# EAGLE design ble113_breakout_board_v11 (EAGLE 7.7.0)
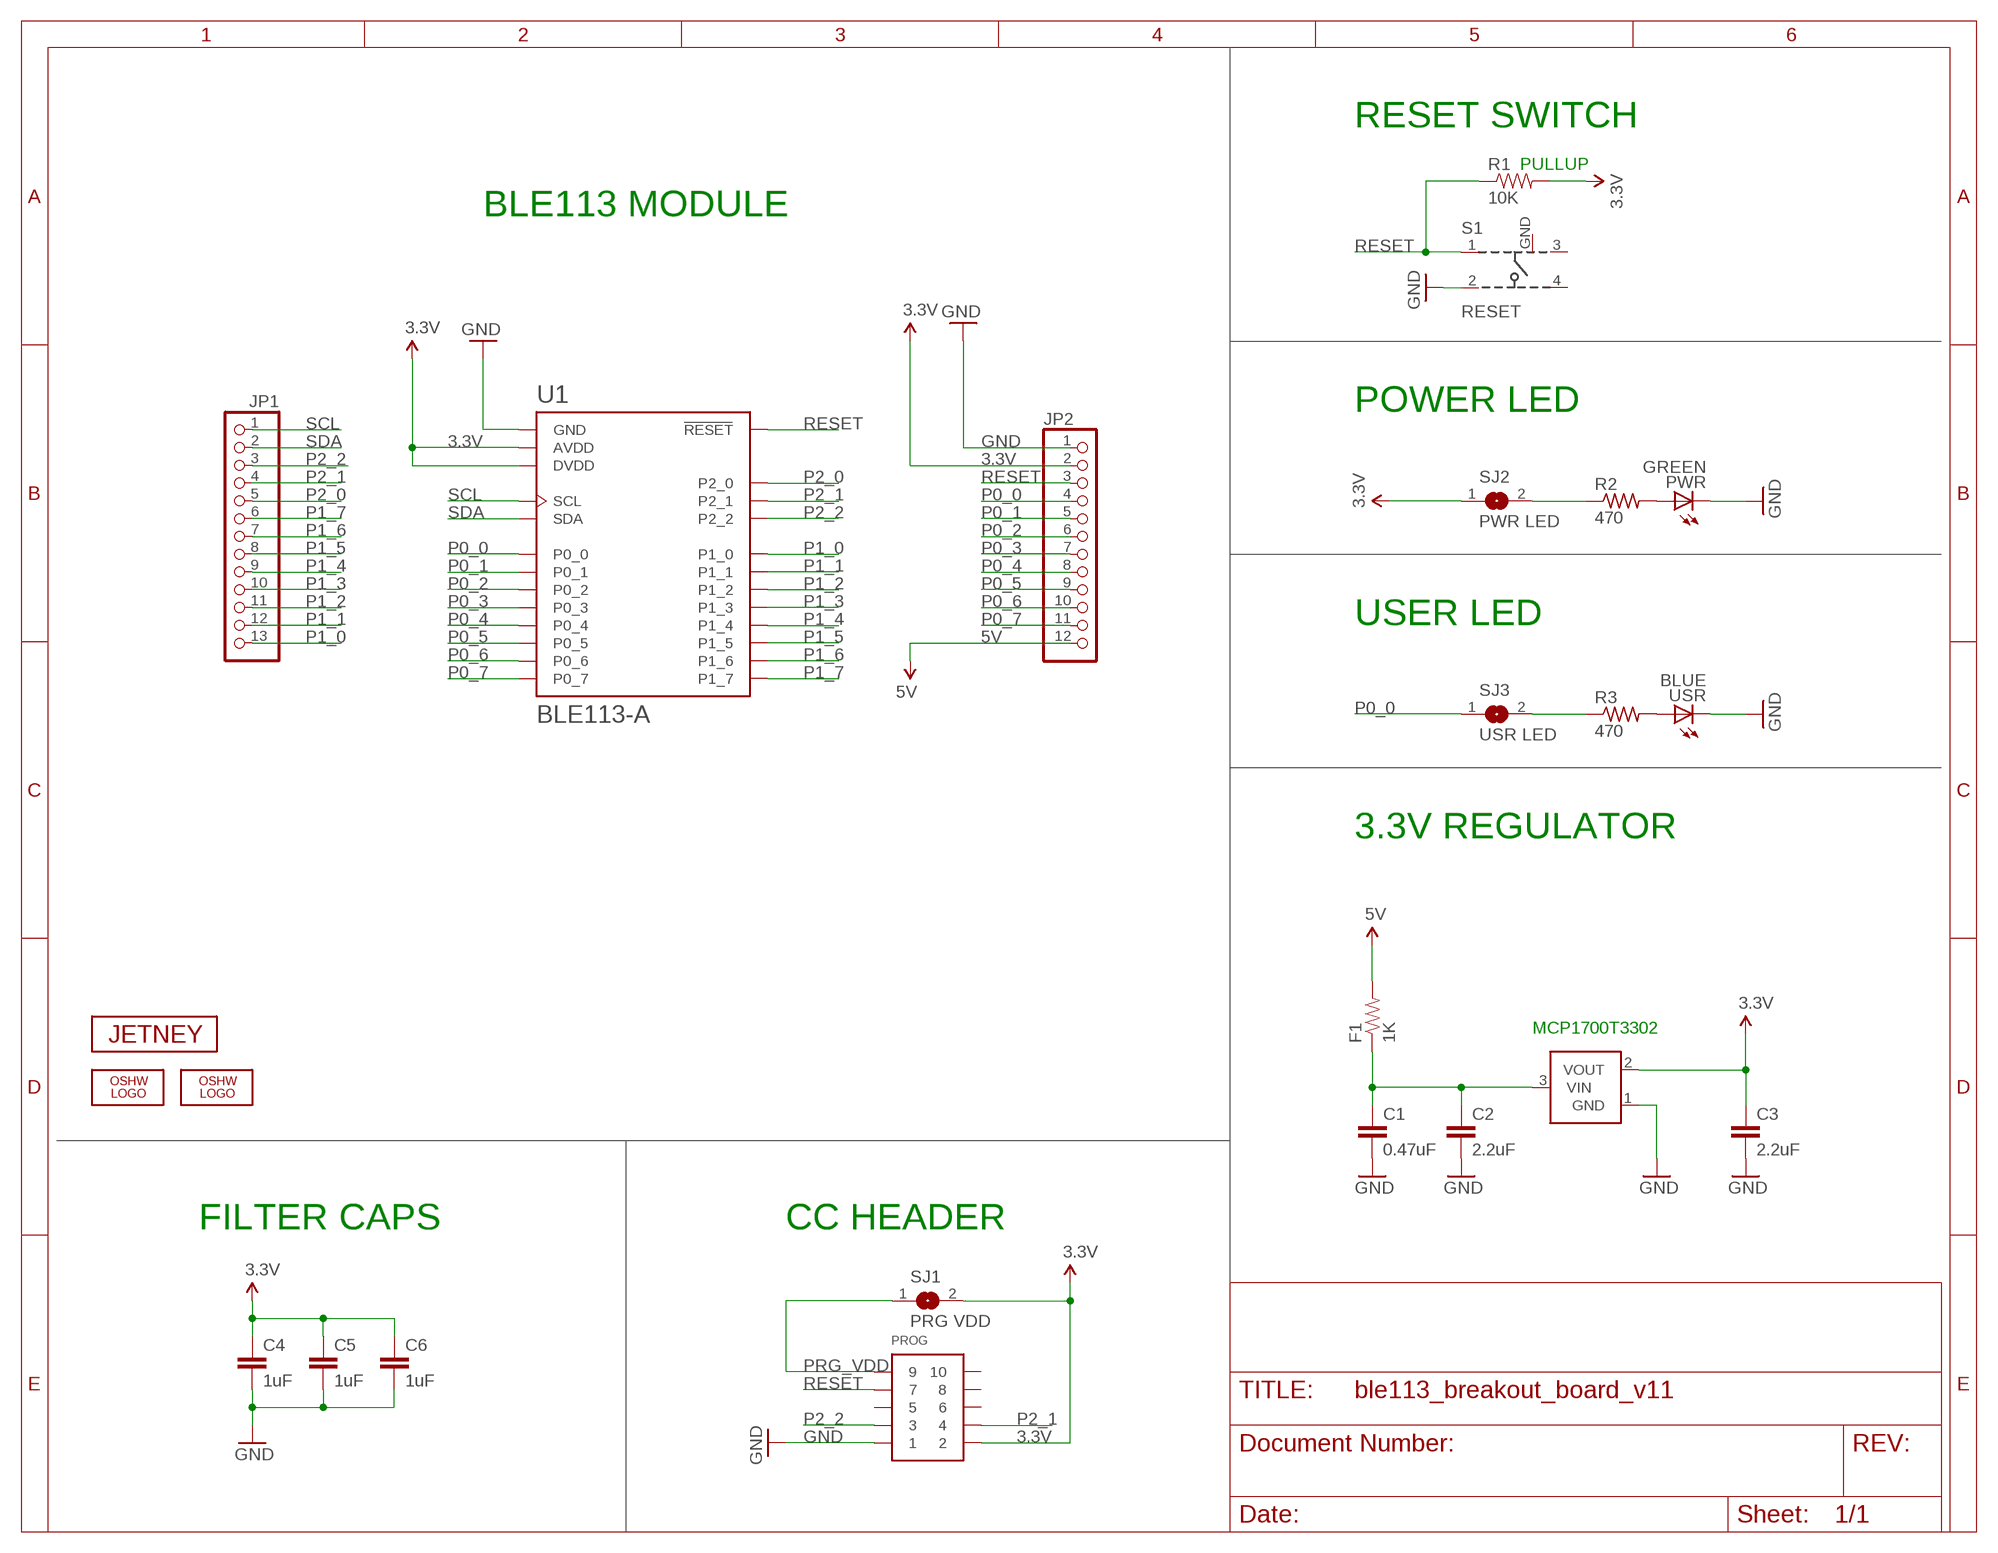
[diagram p0: schematic, sheet 1]

## Parts
C1  0.47uF  CAP0603-CAP  [0603-CAP]
C2  2.2uF  CAP0603-CAP  [0603-CAP]
C3  2.2uF  CAP0603-CAP  [0603-CAP]
C4  1uF  CAP0603-CAP  [0603-CAP]
C5  1uF  CAP0603-CAP  [0603-CAP]
C6  1uF  CAP0603-CAP  [0603-CAP]
F1  1K  RESISTOR0805-RES  [0805]
JP1  PINHD-1X13  [1X13]
JP2  PINHD-1X12  [1X12]
LOGO1  OSHW_LOGO_FILLX0100-NT  [OSHW_FILLX100_NOTEXT]
LOGO2  OSHW_LOGO_FILLX0070-NT  [OSHW_FILLX70_NOTEXT]
PROG  CONN_5-2-FTSH-V  [FTSH-105-DV]
PWR  GREEN  LEDCHIPLED_0805  [CHIPLED_0805]
R1  10K  RESISTOR0603-RES  [0603-RES]
R2  470  R-US_R0603  [R0603]
R3  470  R-US_R0603  [R0603]
S1  RESET  101-IG  [101-IG]
SJ1  PRG VDD  SJ  [SJ]
SJ2  PWR LED  SJ  [SJ]
SJ3  USR LED  SJ  [SJ]
U1  BLE113-A  [BLE113-A]
U2  MCP1700  [SOT23-3]
U$2  JETNEY-LOGO-12  [JETNEY-LOGO-12]
USR  BLUE  LEDCHIPLED_0805  [CHIPLED_0805]

## Nets
3.3V [power]: C3.1 C4.1 C5.1 C6.1 JP2.2 PROG.2 R1.2 SJ1.2 SJ2.1 U1.AVDD U1.DVDD U2.2(VOUT)
5V [power]: F1.2 JP2.12
5VF [power]: C1.1 C2.1 F1.1 U2.3(VIN)
GND [power]: C1.2 C2.2 C3.2 C4.2 C5.2 C6.2 JP2.1 PROG.1 PWR.C S1.2 U1.GND U1.GND@2(GND) U1.GND@3(GND) U1.GND@4(GND) U1.GND@5(GND) U1.GND@6(GND) U1.GND@7(GND) U1.GND@8(GND) U1.GND@9(GND) U1.GND@10(GND) U2.1(GND) USR.C
N$1: PWR.A R2.2
N$3 [power]: R2.1 SJ2.2
N$4: R3.2 USR.A
N$5: R3.1 SJ3.2
P0_0: JP2.4 SJ3.1 U1.P0_0
P0_1: JP2.5 U1.P0_1
P0_2: JP2.6 U1.P0_2
P0_3: JP2.7 U1.P0_3
P0_4: JP2.8 U1.P0_4
P0_5: JP2.9 U1.P0_5
P0_6: JP2.10 U1.P0_6
P0_7: JP2.11 U1.P0_7
P1_0: JP1.13 U1.P1_0
P1_1: JP1.12 U1.P1_1
P1_2: JP1.11 U1.P1_2
P1_3: JP1.10 U1.P1_3
P1_4: JP1.9 U1.P1_4
P1_5: JP1.8 U1.P1_5
P1_6: JP1.7 U1.P1_6
P1_7: JP1.6 U1.P1_7
P2_0: JP1.5 U1.P2_0
P2_1: JP1.4 PROG.4 U1.P2_1
P2_2: JP1.3 PROG.3 U1.P2_2
PRG_VDD [power]: PROG.9 SJ1.1
RESET: JP2.3 PROG.7 R1.1 S1.1 U1.RESET
SCL: JP1.1 U1.SCL
SDA: JP1.2 U1.SDA
Unconnected: PROG.5 PROG.6 PROG.8 PROG.10 S1.3 S1.4

## Notes on the sheet
- RESET SWITCH
- PULLUP
- BLE113 MODULE
- POWER LED
- USER LED
- 3.3V REGULATOR
- MCP1700T3302
- FILTER CAPS | CC HEADER

## Power pins joined to a net without a drawn wire
GND: S1.GND

## Library data of the parts
C1-C6 = SparkFun:CAP: Capacitor Standard 0603 ceramic capacitor, and 0.1" leaded capacitor.
F1 R1 = SparkFun:RESISTOR: Resistor Basic schematic elements and footprints for 0603, 1206, and PTH resistors.
JP1 = sf-pinhead:PINHD-1X13: PIN HEADER
JP2 = sf-pinhead:PINHD-1X12: PIN HEADER
LOGO1 LOGO2 = oshw-logo:OSHW_LOGO_FILL
PROG = pel_misc:CONN_5-2
PWR USR = led:LED: LED OSRAM: - CHIPLED LG R971, LG N971, LY N971, LG Q971, LY Q971, LO R971, LY R971 LH N974, LH R974 LS Q976, LO Q976, LY Q976 LO Q996 - Hyper CHIPLED LW Q18S LB Q993, LB Q99A, LB R99A - SideLED LS A670, LO A670, LY A670, LG A670, LP A670 LB A673, LV A673, LT A673, LW A673 LH A674 LY A675 LS A676, LA A676, LO A676, LY A676, LW A676 LS A679, LY A679, LG A679 - Hyper Micro SIDELED® LS Y876, LA Y876, LO Y876, LY Y876 LT Y87S - SmartLED LW L88C, LW L88S LB L89C, LB L89S, LG L890 LS L89K, LO L89K, LY L89K LS L896, LA L896, LO L896, LY L896 - TOPLED LS T670, LO T670, LY T670, LG T670, LP T670 LSG T670, LSP T670, LSY T670, LOP T670, LYG T670 LG T671, LOG T671, LSG T671 LB T673, LV T673, LT T673, LW T673 LH T674 LS T676, LA T676, LO T676, LY T676, LB T676, LH T676, LSB T676, LW T676 LB T67C, LV T67C, LT T67C, LS T67K, LO T67K, LY T67K, LW E67C LS E67B, LA E67B, LO E67B, LY E67B, LB E67C, LV E67C, LT E67C LW T67C LS T679, LY T679, LG T679 LS T770, LO T770, LY T770, LG T770, LP T770 LB T773, LV T773, LT T773, LW T773 LH T774 LS E675, LA E675, LY E675, LS T675 LS T776, LA T776, LO T776, LY T776, LB T776 LHGB T686 LT T68C, LB T68C - Hyper Mini TOPLED® LB M676 - Mini TOPLED Santana® LG M470 LS M47K, LO M47K, LY M47K Source: http://www.osram.convergy.de LUXEON: - LUMILED® LXK2-PW12-R00, LXK2-PW12-S00, LXK2-PW14-U00, LXK2-PW14-V00 LXK2-PM12-R00, LXK2-PM12-S00, LXK2-PM14-U00 LXK2-PE12-Q00, LXK2-PE12-R00, LXK2-PE12-S00, LXK2-PE14-T00, LXK2-PE14-U00 LXK2-PB12-K00, LXK2-PB12-L00, LXK2-PB12-M00, LXK2-PB14-N00, LXK2-PB14-P00, LXK2-PB14-Q00 LXK2-PR12-L00, LXK2-PR12-M00, LXK2-PR14-Q00, LXK2-PR14-R00 LXK2-PD12-Q00, LXK2-PD12-R00, LXK2-PD12-S00 LXK2-PH12-R00, LXK2-PH12-S00 LXK2-PL12-P00, LXK2-PL12-Q00, LXK2-PL12-R00 Source: www.luxeon.com KINGBRIGHT: KA-3528ASYC Source: www.kingbright.com
R2 R3 = resistor:R-US_: RESISTOR, American symbol
S1 = sf-keyglove:101-IG
SJ1-SJ3 = jumper:SJ: SMD solder JUMPER
U1 = sf-bluegiga:BLE113: Bluetooth Low Energy single-mode module - Bluetooth 4.0 (CC2541). BLE113-A variant has an on-module ceramic chip antenna. BLE113-A variant includes keepout/restrict area. Antenna edge of the module should be flush up against the edge of the PCB. See datasheet for variant layout details. The BLE113 is a Bluetooth Smart module targeted for small and low-power sensors and accessories. It integrates all features required for a Bluetooth Smart application, including Bluetooth radio, software stack, and GATT-based profiles. The BLE113 Bluetooth Smart module can also host end-user applications, which means no external micro controller is required in size or price constrained devices. Moreover, it has flexible hardware interfaces to connect to different peripherals and sensors and can be powered directly from a standard 3V coin cell battery or a pair of AAA batteries. In the lowest power sleep mode it merely consumes 500 nA and will wake up within a few hundred microseconds. The BLE113 Bluetooth Smart module conusmer approximately 30% less power and is smaller than the BLE112 Bluetooth Smart Module. http://www.bluegiga.com/en-US/products/bluetooth-4.0-modules/ble113-bluetooth--smart-module https://github.com/jrowberg/sf-oshw Last updated 2014-01-04 by Jeff Rowberg <jeff@rowberg.net>; ANTENNA: On-module ceramic chip antenna
U2 = nonolith:MCP1700: Voltage regulator
U$2 = sf-keyglove:JETNEY-LOGO

## Net classes
0 default: width 0.152 mm, drill 0.33 mm, clearance 0.152 mm
1 power: width 0.254 mm, drill 0.33 mm, clearance 0.152 mm

## Board
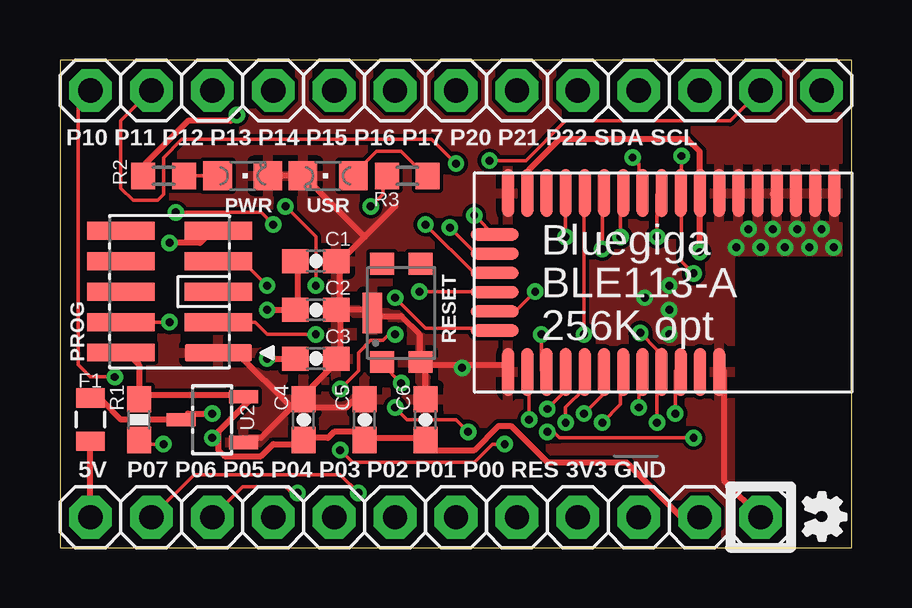
[diagram p1: board, top side]
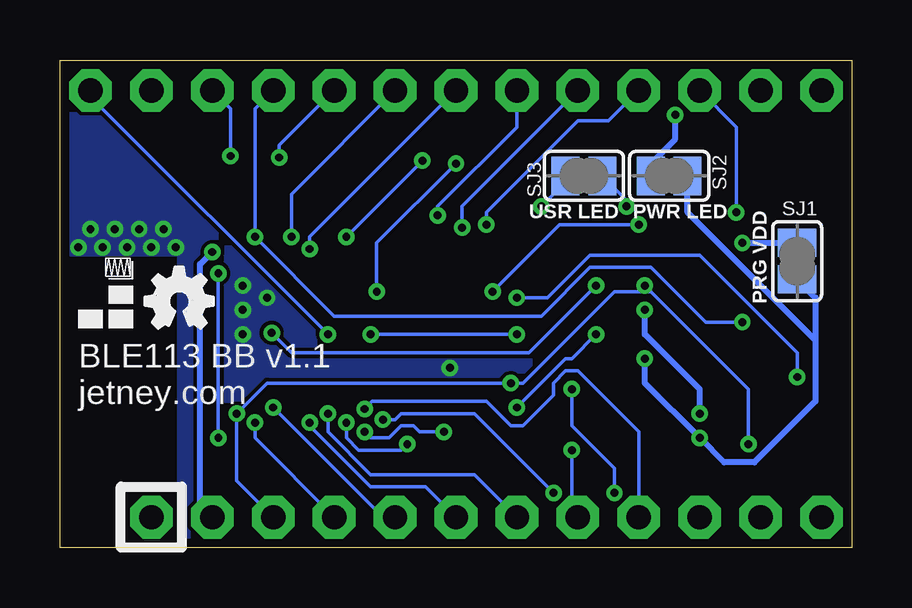
[diagram p2: board, bottom side, seen from below]

Size 33.02 x 20.32 mm. Coordinates in mm from the lower left corner, seen from the top.
Outline: 0,0 33.02,0 33.02,20.32 0,20.32 0,0
Copper layers (1*16): Top 0.0356mm / dielectric 1.5011mm / Bottom 0.0356mm
Design rules "default": minimum track width 6mil, minimum drill 13mil, track to track 6mil, track to pad 6mil, pad to pad 6mil, via to via 6mil, smd to smd 6mil, copper to edge 15mil, drill to drill 6mil, minimum pad ring 7mil, minimum via ring 7mil, stop-mask expansion 4mil, vias tented up to drill 13mil, thermal gap 10mil
vRestrict: area 0.3,16.8 to 32.8,17.5; area 0.3,2.8 to 30.5,3.7

### Footprints (pad centres in the part's own frame; a part is rotated, then mirrored left to right if it is on the bottom)
0603-CAP = smd 1.1 x 1: 1 -0.85,0; 2 0.85,0
0805 = smd 0.8 x 1.2: 1 -0.9,0; 2 0.9,0
1X13 = drill 1.016 pad 1.778 octagon: 1 -15.24,0; 2 -12.7,0; 3 -10.16,0; 4 -7.62,0; 5 -5.08,0; 6 -2.54,0; 7 0,0; 8 2.54,0; 9 5.08,0; 10 7.62,0; 11 10.16,0; 12 12.7,0; 13 15.24,0
1X12 = drill 1.016 pad 1.778 octagon: 1 -13.97,0; 2 -11.43,0; 3 -8.89,0; 4 -6.35,0; 5 -3.81,0; 6 -1.27,0; 7 1.27,0; 8 3.81,0; 9 6.35,0; 10 8.89,0; 11 11.43,0; 12 13.97,0
FTSH-105-DV = smd 0.74 x 2.8: 1 -2.54,-2.03; 2 -2.54,2.03; 3 -1.27,-2.03; 4 -1.27,2.03; 5 0,-2.03; 6 0,2.03; 7 1.27,-2.03; 8 1.27,2.03; 9 2.54,-2.03; 10 2.54,2.03
CHIPLED_0805 = smd 1.2 x 1.2: A 0,-1.05; C 0,1.05
0603-RES = smd 1.1 x 1: 1 -0.85,0; 2 0.85,0
R0603 = smd 1 x 1.1: 1 -0.85,0; 2 0.85,0
101-IG = smd 0.9 x 1: 1 -2.05,0.8; 2 -2.05,-0.8; 3 2.05,0.8; 4 2.05,-0.8 | smd 1.7 x 0.8: GND 0,1.2
SJ = smd 1.168 x 1.6: 1 -0.762,0; 2 0.762,0
BLE113-A = smd 2 x 0.5: AVDD -3.725,1.538; DVDD -3.725,-5.662; GND -3.725,7.138; GND@2 -3.725,6.338; GND@3 -3.725,5.537; GND@4 -3.725,4.737; GND@5 -3.725,3.938; GND@6 -3.725,3.138; GND@7 -3.725,2.337; GND@8 -3.725,-6.463; GND@9 3.725,-6.463; GND@10 3.725,2.337; NC -3.725,-4.862; NC@2 3.725,1.538; P0_0 3.725,-0.062; P0_1 3.725,-0.863; P0_2 3.725,-1.663; P0_3 3.725,-2.462; P0_4 3.725,-3.263; P0_5 3.725,-4.062; P0_6 3.725,-4.862; P0_7 3.725,-5.662; P1_6 -3.725,-2.462; P1_7 -3.725,-1.663; P2_0 -3.725,-0.863; P2_1 -3.725,-0.062; P2_2 -3.725,0.738; RESET 3.725,0.738; SCL -3.725,-3.263; SDA -3.725,-4.062 | smd 0.5 x 2: P1_0 2,-7.013; P1_1 1.2,-7.013; P1_2 0.4,-7.013; P1_3 -0.4,-7.013; P1_4 -1.2,-7.013; P1_5 -2,-7.013
SOT23-3 = smd 0.55 x 1.2: 1 0.95,1.3; 2 -0.95,1.3; 3 0,-1.3

### Placement (x,y rotation side)
C1  10.67,11.94 0 top
C2  10.67,9.91 0 top
C3  10.67,7.87 0 top
C4  10.16,5.33 90 top
C5  12.7,5.33 90 top
C6  15.24,5.33 90 top
F1  1.27,5.33 270 top
JP1  16.51,19.05 180 top
JP2  15.24,1.27 180 top
LOGO1  29.46,9.14 0 bottom
LOGO2  30.99,2.29 270 top
PROG  4.57,10.67 90 top
PWR  7.62,15.49 270 top
R1  3.3,5.33 90 top
R2  4.32,15.49 0 top
R3  14.48,15.49 0 top
S1  14.22,9.78 90 top
SJ1  2.29,11.94 270 bottom
SJ2  7.62,15.49 180 bottom
SJ3  11.18,15.49 180 bottom
U1  25.15,11.05 270 top
U2  6.35,5.33 270 top
U$2  32.26,9.14 0 bottom
USR  11.18,15.49 90 top

### Tracks (layer width: path | path; a pad name or v marks a point on that pad's centre or on a via)
3.3V  (via drill 0.33)
  Top 0.254: v8.64,7.87 C3.1 | 12.7,4.57 12.45,4.83 11.43,4.83 11.18,4.57 10.16,4.57 C4.1 10.16,4.32 8.89,4.32 8.38,3.81 6.86,3.81 6.6,4.06 6.6,4.57 | 12.7,4.57 15.24,4.57 C6.1 15.24,4.32 15.49,4.06 17.27,4.06 18.29,5.08 18.8,5.08 20.32,3.56 23.62,3.56 25.91,1.27 JP2.2 | 12.7,4.57 C5.1 | 3.3,6.35 7.62,6.35 U2.2 7.87,6.1 6.6,4.83 6.6,4.57 | 3.3,6.35 3.3,7.62 2.79,8.13 PROG.2 | 3.3,6.35 R1.2 | v26.67,12.32 26.67,14.73 U1.AVDD 26.67,14.99 26.67,16.51 26.16,17.02 20.83,17.02 19.56,15.75 19.56,14.99 U1.DVDD | 6.6,4.57 v6.35,4.57
  Bottom 0.254: v8.64,7.87 8.64,6.86 v6.35,4.57 5.33,3.56 4.06,3.56 1.52,6.1 1.52,8.64 | 1.52,8.64 1.52,10.41 SJ1.2 | SJ2.1 6.86,13.97 1.52,8.64 | v26.67,12.32 27.18,11.81 27.18,1.78 JP2.2
5V
  Top 0.254: JP2.12 F1.2
5VF  (via drill 0.33)
  Top 0.254: C1.1 9.91,11.94 9.91,9.91 C2.1 v8.64,9.91 | F1.1 1.27,6.1 1.78,6.1 2.54,5.33 U2.3 5.08,5.33 5.33,5.59 v6.35,5.59
  Bottom 0.254: v8.64,9.91 8.64,8.89 6.35,6.6 v6.35,5.59
GND  (via drill 0.33)
  Top 0.254: JP2.1 27.69,2.79 27.69,7.37 | 7.62,4.57 U2.1 7.87,4.57 8.38,4.57 9.65,5.84 | 11.68,7.87 10.16,6.35 | C5.2 12.7,6.1 12.19,6.1 11.94,5.84 10.41,5.84 10.16,6.1 C4.2 10.16,6.35 | 10.16,6.35 9.65,5.84 | PROG.1 7.37,8.13 9.65,5.84 | C6.2 15.24,7.62 | 15.24,7.62 18.54,7.62 | 15.24,7.62 S1.2 14.99,7.87 14.99,8.89 14.22,9.65 13.21,9.65 S1.GND 12.95,9.91 11.68,9.91 | PWR.C USR.C 10.16,15.49 12.7,12.95 | 11.68,9.91 11.68,11.94 | 11.68,11.94 12.7,12.95 | 12.7,12.95 13.97,14.22 | 11.68,11.94 C1.2 | 11.68,9.91 11.68,7.87 | 11.68,7.87 C3.2 | 11.68,9.91 C2.2 | 32.26,13.97 32.28,13.97 | 29.72,14.73 U1.GND@4 29.72,14.73
  other vias: 32.26,12.51 31.24,12.51 30.23,12.51 29.21,12.51 28.19,12.51 31.75,13.27 30.73,13.27 29.72,13.27 28.7,13.27 25.4,8.89 25.4,9.91 25.4,10.92 24.38,10.41 16.76,7.49
  pour Bottom: 0,20.32 33.02,20.32 33.02,6.35 27.94,6.35 27.94,0 0,0
  pour Top: 0,20.32 33.02,20.32 33.02,6.35 27.94,6.35 27.94,0 0,0
N$1
  Top 0.152: PWR.A R2.2
N$3  (via drill 0.33)
  Top 0.254: v7.37,18.03 7.11,17.78 5.33,17.78 3.56,16 3.56,15.49 R2.1
  Bottom 0.254: v7.37,18.03 7.37,17.02 8.38,16 SJ2.2
N$4
  Top 0.152: R3.2 15.24,15.49 14.22,16.51 13.21,16.51 12.19,15.49 USR.A
N$5  (via drill 0.33)
  Top 0.152: v12.95,14.22 13.46,14.73 13.46,15.49 R3.1
  Bottom 0.152: v12.95,14.22 11.94,15.24 SJ3.2
N$6
  Bottom 0.152: 7.11,15.49 8.13,15.49
N$8
  Bottom 0.152: 10.67,15.49 11.68,15.49
N$9
  Bottom 0.152: 2.29,11.43 2.29,12.45
P0_0  (via drill 0.33)
  Top 0.152: v24.89,5.21 24.89,7.3 | v9.4,14.22 10.67,12.95 v10.67,10.92 | v24.19,8.95 24.89,8.26 24.89,7.3 | 24.89,7.3 U1.P0_0
  Bottom 0.152: v24.89,5.21 24.89,4.57 JP2.4 | SJ3.1 9.4,14.48 v9.4,14.22 | v10.67,10.92 13.46,8.13 23.37,8.13 v24.19,8.95
P0_1  (via drill 0.33)
  Top 0.152: v24.13,5.84 24.13,7.37 U1.P0_1
  Bottom 0.152: v24.13,5.84 19.56,1.27 JP2.5
P0_2  (via drill 0.33)
  Top 0.152: v22.61,5.21 23.37,5.97 23.37,7.37 U1.P0_2
  Bottom 0.152: v22.61,5.21 22.61,5.08 20.07,2.54 17.78,2.54 JP2.6
P0_3  (via drill 0.33)
  Top 0.152: v21.84,5.59 22.61,6.35 22.61,7.37 U1.P0_3
  Bottom 0.152: v21.84,5.59 21.84,4.83 20.07,3.05 15.75,3.05 JP2.7
P0_4  (via drill 0.33)
  Top 0.152: v21.08,5.21 21.08,5.84 21.84,6.6 21.84,7.37 U1.P0_4 | v18.54,4.32 18.03,4.32 17.27,3.56 12.19,3.56 v11.68,4.06
  Bottom 0.152: v21.08,5.21 21.08,4.57 20.57,4.06 18.8,4.06 v18.54,4.32 | v11.68,4.06 11.68,1.52 JP2.8
P0_5  (via drill 0.33)
  Top 0.152: v20.32,5.78 21.08,6.54 21.08,7.37 U1.P0_5
  Bottom 0.152: v20.32,5.78 20,6.1 15.24,6.1 14.22,5.08 13.72,5.08 12.45,6.35 12.45,6.86 11.94,7.37 11.43,7.37 8.89,4.83 JP2.9
P0_6  (via drill 0.33)
  Top 0.152: v20.07,8.89 20.07,7.37 U1.P0_6 | v13.97,8.89 13.72,8.89 13.46,8.64 12.95,8.64 12.45,8.13 12.45,7.37 v11.68,6.6 | v9.91,2.29 9.65,2.29 9.4,2.54 7.62,2.54 JP2.10
  Bottom 0.152: v13.97,8.89 v20.07,8.89 | v11.68,6.6 11.68,5.08 9.91,3.3 v9.91,2.29
P0_7  (via drill 0.33)
  Top 0.152: v19.56,5.33 19.56,7.37 U1.P0_7 | v12.45,2.29 11.68,3.05 5.59,3.05 JP2.11
  Bottom 0.152: v19.56,5.33 19.05,5.33 18.8,5.59 15.75,5.59 v12.45,2.29
P1_0  (via drill 0.33)
  Top 0.152: v13.97,10.41 15.24,9.14 18.29,9.14 U1.P1_0 | v2.29,7.11 1.27,7.11 0.76,7.62 0.76,18.54 JP1.13
  Bottom 0.152: v13.97,10.41 12.7,10.41 10.92,12.19 6.35,12.19 2.29,8.13 v2.29,7.11
P1_1  (via drill 0.33)
  Top 0.152: v19.81,10.67 19.05,9.91 18.29,9.91 U1.P1_1 | v16.51,16 15.49,17.02 5.08,17.02 4.32,16.26 4.32,14.73 4.06,14.48 3.05,14.48 2.54,14.99 2.54,17.78 JP1.12
  Bottom 0.152: v19.81,10.67 19.81,12.7 v16.51,16
P1_2  (via drill 0.33)
  Top 0.152: v14.99,10.67 18.29,10.67 U1.P1_2 | v4.83,13.97 8.38,13.97 v8.89,13.46
  Bottom 0.152: v14.99,10.67 12.19,13.46 v8.89,13.46 | v4.83,13.97 4.83,17.53 JP1.11
P1_3  (via drill 0.33)
  Top 0.152: v15.24,13.46 17.27,11.43 18.29,11.43 U1.P1_3
  Bottom 0.152: v15.24,13.46 15.24,13.97 11.43,17.78 10.16,17.78 JP1.10
P1_4  (via drill 0.33)
  Top 0.152: v16.26,13.34 17.4,12.19 18.29,12.19 U1.P1_4
  Bottom 0.152: v16.26,13.34 16.26,14.22 JP1.9
P1_5  (via drill 0.33)
  Top 0.152: v17.27,13.84 18.16,12.95 18.29,12.95 U1.P1_5
  Bottom 0.152: v17.27,13.84 17.27,14.22 13.97,17.53 JP1.8
P1_6  (via drill 0.33)
  Top 0.152: v22.61,12.45 22.61,14.73 U1.P1_6
  Bottom 0.152: v22.61,12.45 22.61,12.95 JP1.7
P1_7  (via drill 0.33)
  Top 0.152: v23.37,12.95 23.37,14.73 U1.P1_7
  Bottom 0.152: v23.37,12.95 23.37,14.73 JP1.6
P2_0  (via drill 0.33)
  Top 0.152: 24.13,14.99 24.13,16 v23.88,16.26 | 24.13,14.99 24.13,14.48 | 24.13,14.99 U1.P2_0
  Bottom 0.152: v23.88,16.26 23.88,16.76 JP1.5
P2_1  (via drill 0.33)
  Top 0.152: v24.89,12.95 24.89,14.73 U1.P2_1 | v4.57,9.4 PROG.4
  Bottom 0.152: JP1.4 24.89,18.29 v24.89,12.95 21.59,9.65 12.95,9.65 10.92,11.68 8.38,11.68 6.1,9.4 v4.57,9.4
P2_2  (via drill 0.33)
  Top 0.152: v25.91,16.32 25.91,14.99 | 25.91,14.99 25.91,14.48 | PROG.3 8.13,9.4 8.64,8.89 v10.67,8.89 | v13.97,5.84 14.48,5.33 16.51,5.33 v17.02,4.83 | v20.32,4.83 20.57,4.83 20.83,4.57 v26.42,4.57 | v26.42,11.43 25.91,11.94 25.91,14.48 | 25.91,14.99 U1.P2_2 25.91,14.48
  Bottom 0.152: v25.91,16.32 25.91,18.29 JP1.3 | v10.67,8.89 11.68,7.87 11.94,7.87 v13.97,5.84 | v17.02,4.83 18.03,4.83 18.29,5.08 18.8,5.08 19.3,4.57 20.07,4.57 v20.32,4.83 | v26.42,11.43 v26.42,4.57
PRG_VDD  (via drill 0.33)
  Top 0.254: v4.57,12.7 5.84,12.7 6.35,13.21 PROG.9
  Bottom 0.254: v4.57,12.7 SJ1.1
RESET  (via drill 0.33)
  Top 0.152: v14.22,6.86 13.46,7.62 S1.1 | v4.32,4.32 3.3,4.32 R1.1 | v25.65,5.59 25.65,7.37 U1.RESET | PROG.7 7.62,11.94 v8.64,10.92
  Bottom 0.152: JP2.3 25.65,2.79 v25.65,5.59 24.38,6.86 v14.22,6.86 13.72,6.86 9.91,10.67 8.64,10.67 | v4.32,4.32 4.32,6.6 8.38,10.67 8.64,10.67 | 8.64,10.67 v8.64,10.92
SCL  (via drill 0.33)
  Top 0.152: v21.84,8.89 21.84,14.73 U1.SCL
  Bottom 0.152: v21.84,8.89 31.75,18.8 JP1.1
SDA  (via drill 0.33)
  Top 0.152: v21.08,12.95 21.08,14.73 U1.SDA | v17.91,16.13 19.43,16.13 21.08,17.78 27.94,17.78 JP1.2
  Bottom 0.152: v17.91,16.13 v21.08,12.95

### Text on the board
tPlace: P10 P11 P12 P13 P14 P15 P16 P17 P20 P21 P22 SDA SCL | Bluegiga | BLE113-A | RESET | 256K opt | 5V | P07 P06 P05 P04 P03 P02 P01 P00 RES 3V3 GND
bPlace: PWR LED | USR LED | PRG VDD | BLE113 BB v1.1 | jetney.com